# Altium project MSXIV_RearPowerDistribution.PrjPcb (part 3 of 6)

## Sheet Power Distribution - Power Path.SchDoc: Power Path
size B; Organization: Midnight Sun Solar Rayce Car Team; Address1: University of Waterloo; Address2: 200 University Ave W; Address3: Waterloo, ON, Canada; Address4: N2L 3E9; DocumentNumber: 6; SheetNumber: 6; SheetTotal: 13; Website: www.uwmidsun.com; ProjectName: ProjectName
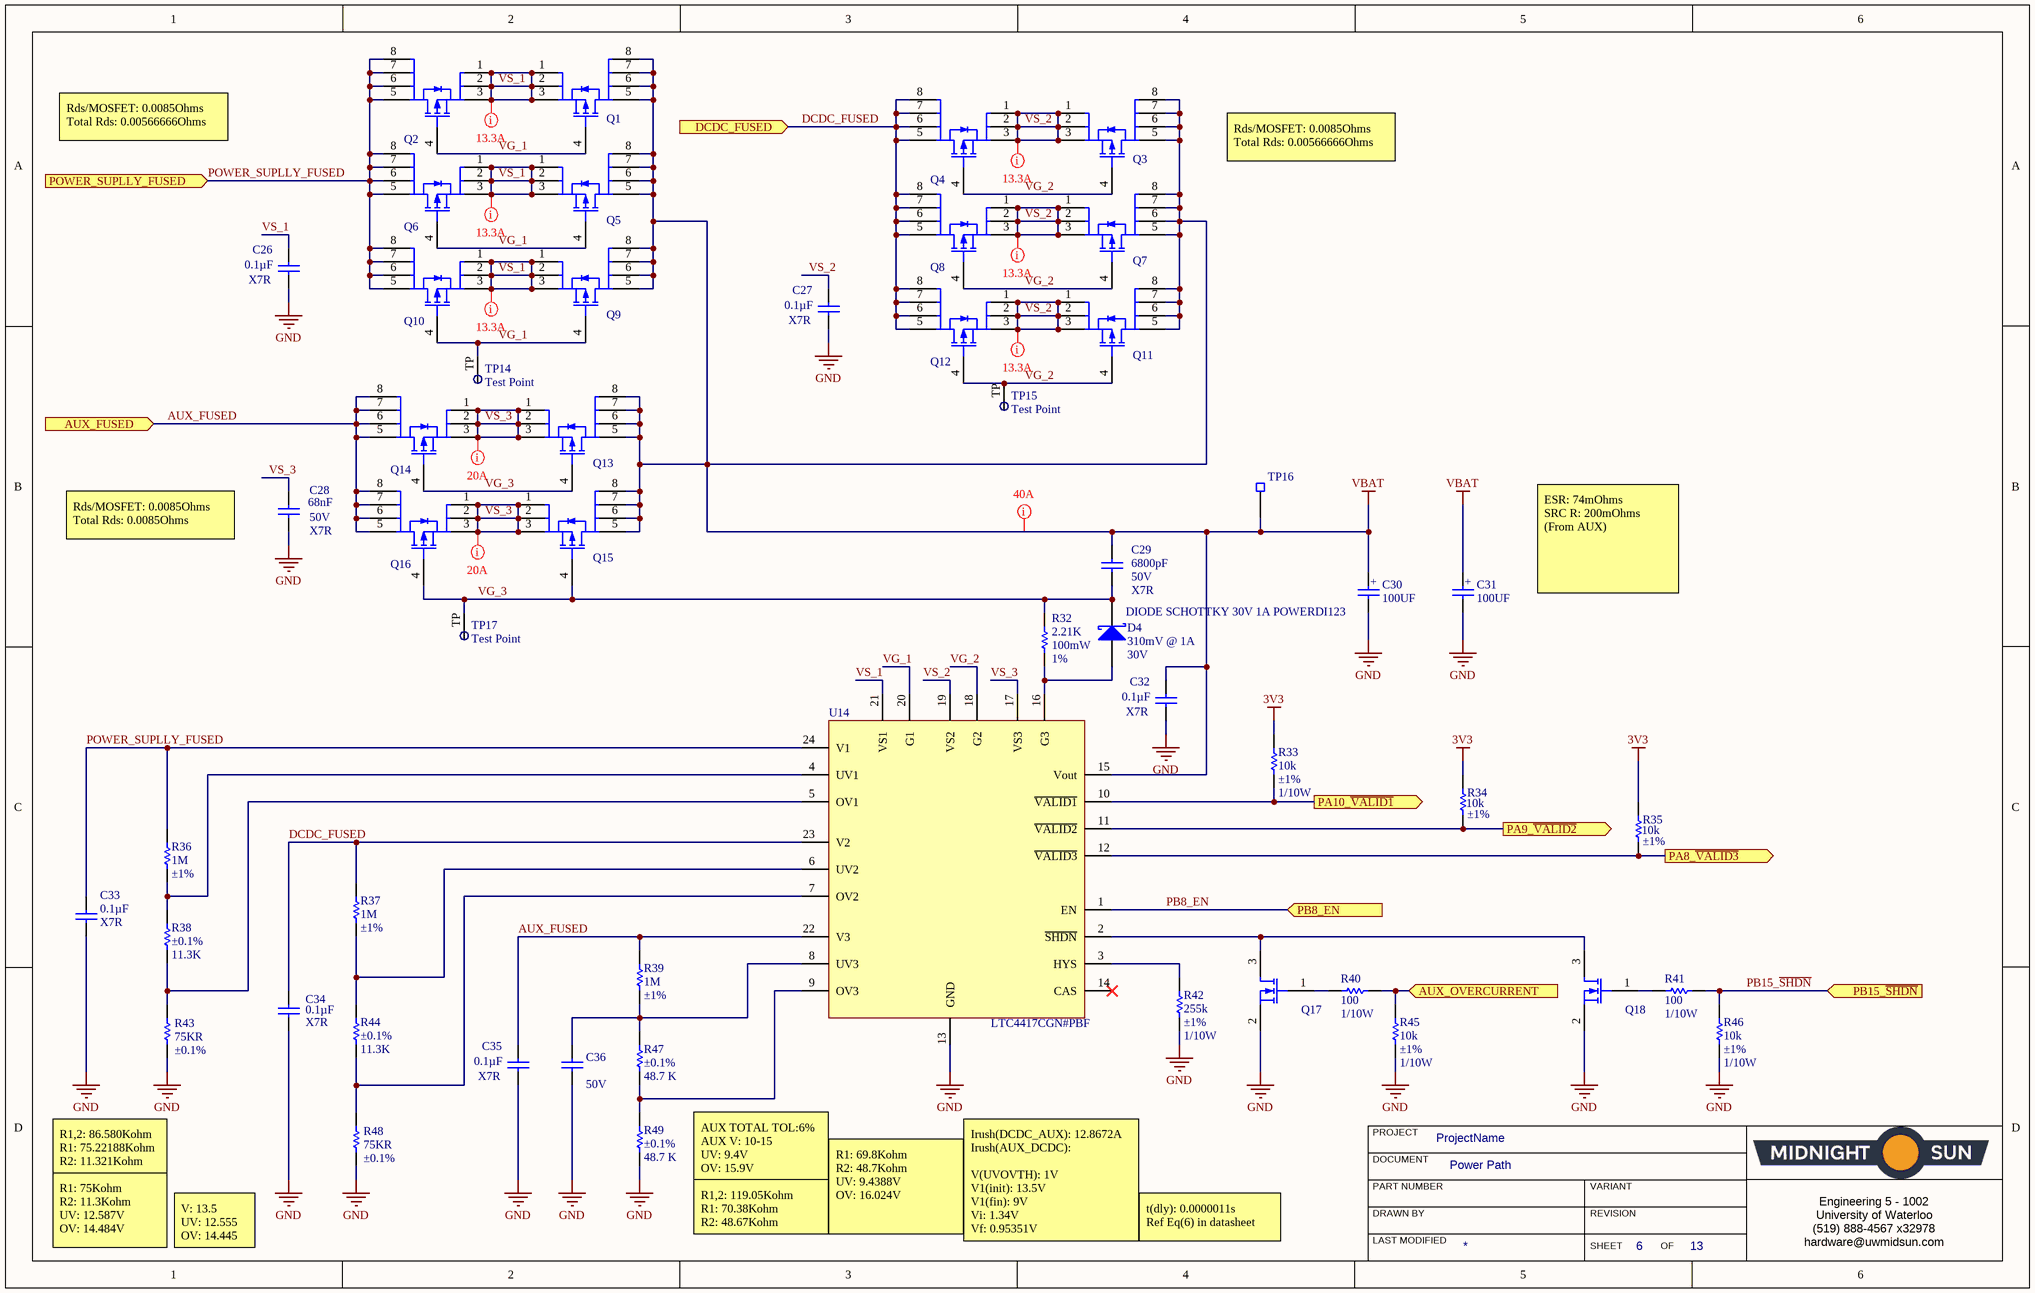
[diagram p5: Power Distribution - Power Path.SchDoc]

### Parts
(Parts that share a designator on the sheet are numbered #1, #2 ... from top to bottom, then left to right.)
C26  Capacitance: 0.1µF  Temperature Coefficient: X7R  [CAP, 0603]  (hidden comment: CAP CER 0.1UF 50V 10% X7R 0603)
C27  Capacitance: 0.1µF  Temperature Coefficient: X7R  [CAP, 0603]  (hidden comment: CAP CER 0.1UF 50V 10% X7R 0603)
C28  68nF  Voltage Rating: 50V  Dielectric: X7R  [CAP, 0603]
C29  Capacitance: 6800pF  Voltage: 50V  Temperature Coefficient: X7R  [CAP, 0603]  (hidden comment: CAP CER 6800pF 50V 10% X7R 0603)
C30  100UF  [CAP ALUM 6.3MM RADIAL SMD]
C31  100UF  [CAP ALUM 6.3MM RADIAL SMD]  (no BOM)
C32  Capacitance: 0.1µF  Temperature Coefficient: X7R  [CAP, 0603]  (hidden comment: CAP CER 0.1UF 50V 10% X7R 0603)
C33  Capacitance: 0.1µF  Temperature Coefficient: X7R  [CAP, 0603]  (hidden comment: CAP CER 0.1UF 50V 10% X7R 0603)
C34  Capacitance: 0.1µF  Temperature Coefficient: X7R  [CAP, 0603]  (hidden comment: CAP CER 0.1UF 50V 10% X7R 0603)
C35  Capacitance: 0.1µF  Temperature Coefficient: X7R  [CAP, 0603]  (hidden comment: CAP CER 0.1UF 50V 10% X7R 0603)
C36#1  Voltage - Rated: 50V  [CAP, 0603]  (hidden comment: CAP CER 0.022UF 50V 10% X7R 0603)
D4  DIODE SCHOTTKY 30V 1A POWERDI123  Voltage - Forward (Vf) (Max) @ If: 310mV @ 1A  Voltage - DC Reverse (Vr) (Max): 30V  [DIODE SCHOTTKY 30V 1A POWERDI123]
Q1  MOSFET P-CH PWR56 40V 4.9 MOHM  [PMOS PWR56 40V 4.9 MOHM]  (value not drawn)
Q2  MOSFET P-CH PWR56 40V 4.9 MOHM  [PMOS PWR56 40V 4.9 MOHM]  (value not drawn)
Q3  MOSFET P-CH PWR56 40V 4.9 MOHM  [PMOS PWR56 40V 4.9 MOHM]  (value not drawn)
Q4  MOSFET P-CH PWR56 40V 4.9 MOHM  [PMOS PWR56 40V 4.9 MOHM]  (value not drawn)
Q5  MOSFET P-CH PWR56 40V 4.9 MOHM  [PMOS PWR56 40V 4.9 MOHM]  (value not drawn)
Q6  MOSFET P-CH PWR56 40V 4.9 MOHM  [PMOS PWR56 40V 4.9 MOHM]  (value not drawn)
Q7  MOSFET P-CH PWR56 40V 4.9 MOHM  [PMOS PWR56 40V 4.9 MOHM]  (value not drawn)
Q8  MOSFET P-CH PWR56 40V 4.9 MOHM  [PMOS PWR56 40V 4.9 MOHM]  (value not drawn)
Q9  MOSFET P-CH PWR56 40V 4.9 MOHM  [PMOS PWR56 40V 4.9 MOHM]  (value not drawn)
Q10  MOSFET P-CH PWR56 40V 4.9 MOHM  [PMOS PWR56 40V 4.9 MOHM]  (value not drawn)
Q11  MOSFET P-CH PWR56 40V 4.9 MOHM  [PMOS PWR56 40V 4.9 MOHM]  (value not drawn)
Q12  MOSFET P-CH PWR56 40V 4.9 MOHM  [PMOS PWR56 40V 4.9 MOHM]  (value not drawn)
Q13  MOSFET P-CH PWR56 40V 4.9 MOHM  [PMOS PWR56 40V 4.9 MOHM]  (value not drawn)
Q14  MOSFET P-CH PWR56 40V 4.9 MOHM  [PMOS PWR56 40V 4.9 MOHM]  (value not drawn)
Q15  MOSFET P-CH PWR56 40V 4.9 MOHM  [PMOS PWR56 40V 4.9 MOHM]  (value not drawn)
Q16  MOSFET P-CH PWR56 40V 4.9 MOHM  [PMOS PWR56 40V 4.9 MOHM]  (value not drawn)
Q17  MOSFET N-CH 30V 6.2A 0.9W SOT-23  [MOSFET N-CH 30V 6.2A 0.9W SOT-23]  (value not drawn)
Q18  MOSFET N-CH 30V 6.2A 0.9W SOT-23  [MOSFET N-CH 30V 6.2A 0.9W SOT-23]  (value not drawn)
R32  2.21K  Tolerance: 1%  Max Power Dissipation: 100mW  [RES, 0603]
R33  Resistance: 10k  Tolerance: ±1%  Power: 1/10W  [RES, 0603]  (hidden comment: RES 10K OHM 1% 1/10W 0603)
R34  Resistance: 10k  Tolerance: ±1%  [RES, 0603]  (hidden comment: RES 10K OHM 1% 1/10W 0603)
R35  Resistance: 10k  Tolerance: ±1%  [RES, 0603]  (hidden comment: RES 10K OHM 1% 1/10W 0603)
R36  Resistance (Ohms): 1M  Tolerance: ±1%  [RES, 0603]  (hidden comment: RES 1M OHM 1% 1/10W 0603)
R37  Resistance (Ohms): 1M  Tolerance: ±1%  [RES, 0603]  (hidden comment: RES 1M OHM 1% 1/10W 0603)
R38  value 11.3K  Tolerance: ±0.1%  [RES, 0603]  (hidden comment: RES SMD 11.3KOHM 0.1% 1/10W 0603)
R39  Resistance (Ohms): 1M  Tolerance: ±1%  [RES, 0603]  (hidden comment: RES 1M OHM 1% 1/10W 0603)
R40  Resistance: 100  Power: 1/10W  [RES, 0603]  (hidden comment: RES 100 OHM 1% 1/10W 0603)
R41  Resistance: 100  Power: 1/10W  [RES, 0603]  (hidden comment: RES 100 OHM 1% 1/10W 0603)
R42  Resistance (Ohms): 255k  Tolerance: ±1%  Power (Watts): 1/10W  [RES, 0603]  (hidden comment: RES 255K OHM 1% 1/10W 0603)
R43  value 75KR  Tolerance: ±0.1%  [RES, 0603]  (hidden comment: RES SMD 75K OHM 0.1% 1/10W 0603)
R44  value 11.3K  Tolerance: ±0.1%  [RES, 0603]  (hidden comment: RES SMD 11.3KOHM 0.1% 1/10W 0603)
R45  Resistance: 10k  Tolerance: ±1%  Power: 1/10W  [RES, 0603]  (hidden comment: RES 10K OHM 1% 1/10W 0603)
R46  Resistance: 10k  Tolerance: ±1%  Power: 1/10W  [RES, 0603]  (hidden comment: RES 10K OHM 1% 1/10W 0603)
R47  value 48.7 K  Tolerance: ±0.1%  [RES, 0603]  (hidden comment: RES SMD 48.7KOHM 0.1% 1/10W 0603)
R48  value 75KR  Tolerance: ±0.1%  [RES, 0603]  (hidden comment: RES SMD 75K OHM 0.1% 1/10W 0603)
R49  value 48.7 K  Tolerance: ±0.1%  [RES, 0603]  (hidden comment: RES SMD 48.7KOHM 0.1% 1/10W 0603)
TP14  Test Point  [Test Point]  (no BOM)
TP15  Test Point  [Test Point]  (no BOM)
TP16  Test Point 0603 SMD  [TEST POINT 0603 SMD]  (value not drawn)
TP17  Test Point  [Test Point]  (no BOM)
U14  Manufacturer Part Number 1: LTC4417CGN#PBF  [IC OR CTRLR SRC SELECT 24SSOP]  (hidden comment: IC OR CONTROLLER SOURCE SELECT 24SSOP)

### Ports
AUX_FUSED (in), AUX_OVERCURRENT (in), DCDC_FUSED (in), PA8_~{VALID3} (out), PA9_~{VALID2} (out), PA10_~{VALID1} (out), PB8_EN (in), PB15_~{SHDN} (in), POWER_SUPLLY_FUSED (in)

### Nets
3V3: R33.1 R34.1 R35.1
GND: C26.2 C27.2 C28.2 C30.2 C31.2 C32.2 C33.2 C34.2 C35.2 C36#1.2 Q17.2(S) Q18.2(S) R42.2 R43.2 R45.2 R46.2 R48.2 R49.2 U14.13(GND)
VBAT: C29.1 C30.1 C31.1 C32.1 Q1.5(D) Q1.6(D) Q1.7(D) Q1.8(D) Q3.5(D) Q3.6(D) Q3.7(D) Q3.8(D) Q5.5(D) Q5.6(D) Q5.7(D) Q5.8(D) Q7.5(D) Q7.6(D) Q7.7(D) Q7.8(D) Q9.5(D) Q9.6(D) Q9.7(D) Q9.8(D) Q11.5(D) Q11.6(D) Q11.7(D) Q11.8(D) Q13.5(D) Q13.6(D) Q13.7(D) Q13.8(D) Q15.5(D) Q15.6(D) Q15.7(D) Q15.8(D) TP16.1 U14.15(Vout)
AUX_FUSED: C35.1 Q14.5(D) Q14.6(D) Q14.7(D) Q14.8(D) Q16.5(D) Q16.6(D) Q16.7(D) Q16.8(D) R39.1 U14.22(V3) ; port AUX_FUSED
AUX_OVERCURRENT: R40.2 R45.1 ; port AUX_OVERCURRENT
DCDC_FUSED: C34.1 Q4.5(D) Q4.6(D) Q4.7(D) Q4.8(D) Q8.5(D) Q8.6(D) Q8.7(D) Q8.8(D) Q12.5(D) Q12.6(D) Q12.7(D) Q12.8(D) R37.1 U14.23(V2) ; port DCDC_FUSED
PA8_~{VALID3}: R35.2 U14.12(~{VALID3}) ; port PA8_~{VALID3}
PA9_~{VALID2}: R34.2 U14.11(~{VALID2}) ; port PA9_~{VALID2}
PA10_~{VALID1}: R33.2 U14.10(~{VALID1}) ; port PA10_~{VALID1}
PB8_EN: U14.1(EN) ; port PB8_EN
PB15_~{SHDN}: R41.2 R46.1 ; port PB15_~{SHDN}
POWER_SUPLLY_FUSED: C33.1 Q2.5(D) Q2.6(D) Q2.7(D) Q2.8(D) Q6.5(D) Q6.6(D) Q6.7(D) Q6.8(D) Q10.5(D) Q10.6(D) Q10.7(D) Q10.8(D) R36.1 U14.24(V1) ; port POWER_SUPLLY_FUSED
VG_1: Q1.4(G) Q2.4(G) Q5.4(G) Q6.4(G) Q9.4(G) Q10.4(G) TP14.TP U14.20(G1)
VG_2: Q3.4(G) Q4.4(G) Q7.4(G) Q8.4(G) Q11.4(G) Q12.4(G) TP15.TP U14.18(G2)
VG_3: C29.2 D4.2(K) Q13.4(G) Q14.4(G) Q15.4(G) Q16.4(G) R32.1 TP17.TP
VS_1: C26.1 Q1.1(S) Q1.2(S) Q1.3(S) Q2.1(S) Q2.2(S) Q2.3(S) Q5.1(S) Q5.2(S) Q5.3(S) Q6.1(S) Q6.2(S) Q6.3(S) Q9.1(S) Q9.2(S) Q9.3(S) Q10.1(S) Q10.2(S) Q10.3(S) U14.21(VS1)
VS_2: C27.1 Q3.1(S) Q3.2(S) Q3.3(S) Q4.1(S) Q4.2(S) Q4.3(S) Q7.1(S) Q7.2(S) Q7.3(S) Q8.1(S) Q8.2(S) Q8.3(S) Q11.1(S) Q11.2(S) Q11.3(S) Q12.1(S) Q12.2(S) Q12.3(S) U14.19(VS2)
VS_3: C28.1 Q13.1(S) Q13.2(S) Q13.3(S) Q14.1(S) Q14.2(S) Q14.3(S) Q15.1(S) Q15.2(S) Q15.3(S) Q16.1(S) Q16.2(S) Q16.3(S) U14.17(VS3)
NetC36#1_1: C36#1.1 R39.2 R47.1 U14.8(UV3)
NetD4_1: D4.1(A) R32.2 U14.16(G3)
NetQ17_1: Q17.1(G) R40.1
NetQ17_3: Q17.3(D) Q18.3(D) U14.2(~{SHDN})
NetQ18_1: Q18.1(G) R41.1
NetR36_2: R36.2 R38.1 U14.4(UV1)
NetR37_2: R37.2 R44.1 U14.6(UV2)
NetR38_2: R38.2 R43.1 U14.5(OV1)
NetR42_1: R42.1 U14.3(HYS)
NetR44_2: R44.2 R48.1 U14.7(OV2)
NetR47_2: R47.2 R49.1 U14.9(OV3)

Not connected (* = marked no-connect by the designer): U14 14(CAS)*

### Layout directives
net class HighCurrent; rule Power Plane Connect Style [Style - Direct Connect]; rule Polygon Connect Style [Style - Direct Connect]: VBAT, VS_1, VS_2, VS_3

### Notes on the sheet
- Rds/MOSFET: 0.0085Ohms
  Total Rds: 0.00566666Ohms
- Rds/MOSFET: 0.0085Ohms
  Total Rds: 0.0085Ohms
- ESR: 74mOhms
  SRC R: 200mOhms (From AUX)
- R1,2: 86.580Kohm
  R1: 75.22188Kohm
  R2: 11.321Kohm
- AUX TOTAL TOL:6%
  AUX V: 10-15
  UV: 9.4V
  OV: 15.9V
- R1: 75Kohm
  R2: 11.3Kohm
  UV: 12.587V
  OV: 14.484V
- V: 13.5
  UV: 12.555
  OV: 14.445
- R1,2: 119.05Kohm
  R1: 70.38Kohm
  R2: 48.67Kohm
- R1: 69.8Kohm
  R2: 48.7Kohm
  UV: 9.4388V
  OV: 16.024V
- Irush(DCDC_AUX): 12.8672A
  Irush(AUX_DCDC):
  V(UVOVTH): 1V
  V1(init): 13.5V
  V1(fin): 9V
  Vi: 1.34V
  Vf: 0.95351V
- t(dly): 0.0000011s
  Ref Eq(6) in datasheet
- PROJECT
- DOCUMENT
- DRAWN BY
- LAST MODIFIED
- PART NUMBER
- REVISION
- SHEET
- VARIANT
- OF
- Engineering 5 - 1002
  University of Waterloo
  (519) 888-4567 x32978
  hardware@uwmidsun.com
- (in symbol CAP ALUM 100UF 20% 35V SMD) +

### Library data of the parts
C26 C27 C32-C35 = CAP CER 0.1UF 50V 10% X7R 0603: as C1 on sheet Controller_Board_Interface; Supplier 1: Digi-Key; Supplier Part Number 1: 478-5052-1-ND; Packaging: Cut Tape (CT); Part Status: Active; Operating Temperature: -55°C ~ 125°C; Ratings: -; Mounting Type: Surface Mount, MLCC; Package / Case: 0603 (1608 Metric); Size / Dimension: 0.063" L x 0.032" W (1.60mm x 0.81mm); Height - Seated (Max): -; Thickness (Max): 0.035" (0.90mm); Lead Spacing: -; Lead Style: -; ComponentLink1URL: http://datasheets.avx.com/X7RDielectric.pdf; ComponentLink1Description: http://datasheets.avx.com/X7RDielectric.pdf; Tolerance: ±10%; Voltage: 50V
C28 = CAP CER 0.068UF 10% 50V X7R 0603: 0.068µF 50V Ceramic Capacitor X7R 0603 (1608 Metric) 0.063" L x 0.032" W (1.60mm x 0.80mm); Manufacturer: Murata; Manufacturer Part Number: GCM188R71H683KA57D; Tolerance: 10%; Supplier 1: Digi-Key; Stock 1: 40000; Pricing 1: 1=0.16, 10=0.116, 100=0.0547, 500=0.03832, 1000=0.03172 (USD); Mount: Surface Mount; Case/Package: 0603; Case Code (Metric): 1608; Case Code (Imperial): 0603; Min Operating Temperature: -55°C; Max Operating Temperature: 125°C; Packaging: Tape and Reel; Capacitance: 68nF; Package Quantity: 4000; Voltage Rating (DC): 50V; Termination: SMD/SMT; Length: 1.6mm; Height: 0.8mm; Width: 0.031inch; Thickness: 0.035inch; Depth: 0.8mm; Radiation Hardening: No; ComponentLink1URL: https://datasheet.ciiva.com/29542/s0717e-29542427.pdf; ComponentLink1Description: https://datasheet.ciiva.com/29542/s0717e-29542427.pdf; ComponentLink2URL: https://datasheet.ciiva.com/29542/s0717e-29542428.pdf; ComponentLink2Description: https://datasheet.ciiva.com/29542/s0717e-29542428.pdf; ComponentLink3URL: https://datasheet.ciiva.com/29542/s0717e-29542429.pdf; ComponentLink3Description: https://datasheet.ciiva.com/29542/s0717e-29542429.pdf; Supplier Part Number 1: 490-8027-1-ND
C29 = CAP CER 6800pF 50V 10% X7R 0603: 6800pF ±10% 50V Ceramic Capacitor X7R 0603 (1608 Metric); Manufacturer 1: Samsung Electro-Mechanics America, Inc.; Manufacturer Part Number 1: CL10B682KB8SFNC; Supplier 1: Digi-Key; Supplier Part Number 1: 1276-2103-1-ND; Packaging: Cut Tape (CT); Part Status: Active; Operating Temperature: -55°C ~ 125°C; Ratings: -; Mounting Type: Surface Mount, MLCC; Package / Case: 0603 (1608 Metric); Size / Dimension: 0.063" L x 0.031" W (1.60mm x 0.80mm); Height - Seated (Max): -; Thickness (Max): 0.035" (0.90mm); Lead Spacing: -; Lead Style: -; ComponentLink1URL: http://www.samsungsem.com/kr/support/product-search/mlcc/CL10B682KB8SFNC.jsp; ComponentLink1Description: http://www.samsungsem.com/kr/support/product-search/mlcc/CL10B682KB8SFNC.jsp; Tolerance: ±10%
C30 C31 = CAP ALUM 100UF 20% 35V SMD: 100µF 35V Aluminum Electrolytic Capacitors Radial, Can - SMD 2000 Hrs @ 85°C; Manufacturer 1: Panasonic; Manufacturer Part Number 1: EEE-1VA101XP; Description 1: Cap Aluminum Lytic 100uF 35V 20% (6.3 X 7.7mm) SMD 132mA 2000h 85C Automotive T/R; Tolerance: 20%; Ripple Current: 132mA; Polarity: Polar; Life (Hours): 2000Hour; Leakage Current: 3uA; Supplier 1: Digi-Key; Supplier Part Number 1: PCE3951CT-ND; Stock 1: 170823; Pricing 1: 1=0.44, 10=0.304, 100=0.1822 (USD); Mount: Surface Mount,PCB; Case/Package: Radial; Number of Pins: 8; Contact Plating: Tin; Min Operating Temperature: -40°C; Max Operating Temperature: 85°C; Capacitance: 100uF; Voltage Rating: 35V; Packaging: Tape and Reel; Package Quantity: 900; Ripple Current (AC): 132mA; Voltage Rating (DC): 35V; Termination: SMD/SMT; Voltage: 35V; Diameter: 6.3mm; Length: 8mm; Height: 7.7mm; Height - Seated (Max): 0.303inch; Radiation Hardening: No; REACH SVHC: No SVHC; Lead Free: Lead Free; ComponentLink1URL: https://datasheet.ciiva.com/46378/aba0000ce2-46378341.pdf; ComponentLink1Description: https://datasheet.ciiva.com/46378/aba0000ce2-46378341.pdf; ComponentLink2URL: https://datasheet.ciiva.com/17535/aba0000ce2-17535510.pdf; ComponentLink2Description: https://datasheet.ciiva.com/17535/aba0000ce2-17535510.pdf; ComponentLink3URL: https://datasheet.ciiva.com/30170/11aba0000ce2-30170103.pdf; ComponentLink3Description: https://datasheet.ciiva.com/30170/11aba0000ce2-30170103.pdf; ComponentLink4URL: https://datasheet.ciiva.com/31414/aba0000ce2-31414696.pdf; ComponentLink4Description: https://datasheet.ciiva.com/31414/aba0000ce2-31414696.pdf; ComponentLink5URL: https://datasheet.ciiva.com/24068/aba0000ce2-40801-24068089.pdf; ComponentLink5Description: https://datasheet.ciiva.com/24068/aba0000ce2-40801-24068089.pdf; ComponentLink6URL: https://datasheet.ciiva.com/14591/70255710-14591771.pdf; ComponentLink6Description: https://datasheet.ciiva.com/14591/70255710-14591771.pdf; ComponentLink7URL: https://datasheet.ciiva.com/14600/70255710-14600731.pdf; ComponentLink7Description: https://datasheet.ciiva.com/14600/70255710-14600731.pdf; ComponentLink8URL: https://datasheet.ciiva.com/46374/aba0000ce2-46374427.pdf; ComponentLink8Description: https://datasheet.ciiva.com/46374/aba0000ce2-46374427.pdf; ComponentLink9URL: https://datasheet.ciiva.com/11673/aba0000ce2-11673887.pdf; ComponentLink9Description: https://datasheet.ciiva.com/11673/aba0000ce2-11673887.pdf
C36#1 = CAP CER 0.022UF 50V 10% X7R 0603: 0.022µF ±10% 50V Ceramic Capacitor X7R 0603 (1608 Metric); Manufacturer 1: Murata Electronics North America; Manufacturer Part Number 1: GRM188R71H223KA01D; Description 1: CAP CER 0.022UF 50V X7R 0603; Supplier 1: Digi-Key; Supplier Part Number 1: 490-1517-1-ND; RoHS: RoHS Compliant; Category: Capacitors; Stock 1: 612330; Pricing 1: 1=0.15, 10=0.111, 100=0.0499, 500=0.03564, 1000=0.02801 (CAD); Packaging: Cut Tape (CT); Part Status: Active; Tolerance: ±10%; Temperature Coefficient: X7R; Operating Temperature: -55°C ~ 125°C; Features: -; Ratings: -; Applications: General Purpose; Mounting Type: Surface Mount, MLCC; Package / Case: 0603 (1608 Metric); Size / Dimension: 0.063" L x 0.032" W (1.60mm x 0.80mm); Height - Seated (Max): -; Thickness (Max): 0.035" (0.90mm); Lead Spacing: -; Lead Style: -; ComponentLink1URL: http://search.murata.co.jp/Ceramy/image/img/A01X/G101/ENG/GRM188R71H223KA01-01.pdf; ComponentLink1Description: http://search.murata.co.jp/Ceramy/image/img/A01X/G101/ENG/GRM188R71H223KA01-01.pdf
D4 = DIODE SCHOTTKY 30V 1A POWERDI123: Diode Schottky 30V 1A Surface Mount PowerDI™ 123; Manufacturer: Diodes Incorporated; Manufacturer Part Number: DFLS130L-7; Speed: Fast Recovery =< 500ns, > 200mA (Io); Current - Reverse Leakage @ Vr: 1mA @ 30V; Capacitance @ Vr, F: 76pF @ 10V, 1MHz; Supplier 1: Digi-Key; RoHS: RoHS Compliant; Category: Discrete Semiconductor Products; Stock 1: 68200; Packaging: Cut Tape (CT); Part Status: Active; Diode Type: Schottky; Mounting Type: Surface Mount; Package / Case: POWERDI®123; Supplier Device Package: PowerDI™ 123; Operating Temperature - Junction: -40°C ~ 125°C; ComponentLink1URL: https://www.diodes.com/assets/Datasheets/ds30492.pdf; ComponentLink1Description: https://www.diodes.com/assets/Datasheets/ds30492.pdf; Supplier Part Number 1: DFLS130LDICT-ND; Pricing 1: 1=0.7, 10=0.599, 100=0.447, 500=0.35126, 1000=0.27142 (CAD); Current - Average Rectified (Io): 1A
Q1-Q16 = MOSFET P-CH PWR56 40V 4.9 MOHM: P-Channel 16V 2.5A (Ta) 650mW (Ta) Surface Mount X2-DFN2015-3; Current - Continuous Drain (Id) @ 25°C: 80A (Tc); Drive Voltage (Max Rds On,  Min Rds On): 4.5V, 10V; Vgs(th) (Max) @ Id: 3V @ 250µA; Gate Charge (Qg) (Max) @ Vgs: 107nC @ 10V; Input Capacitance (Ciss) (Max) @ Vds: 4840pF @ 20V; Power Dissipation (Max): 214W (Tj); Rds On (Max) @ Id, Vgs: 4.9mOhm @ 80A, 10V; Packaging: Cut Tape (CT); Part Status: Active; FET Type: P-Channel; Technology: MOSFET (Metal Oxide); Drain to Source Voltage (Vdss): 40V; Vgs (Max): ±16V; FET Feature: -; Operating Temperature: -55°C ~ 175°C (TJ); Mounting Type: Surface Mount; Supplier Device Package: FDWS9508L-F085OSCT-ND; Package / Case: 8-PowerTDFN; ComponentLink1URL: https://www.onsemi.com/pub/Collateral/FDWS9508L-F085-D.PDF; ComponentLink1Description: https://www.onsemi.com/pub/Collateral/FDWS9508L-F085-D.PDF; Supplier 1: Digi-Key; Supplier Part Number 1: FDWS9508L-F085OSCT-ND
Q17 Q18 = MOSFET N-CH 30V 6.2A 0.9W SOT-23: N-Channel 30V 6.2A (Ta) 900mW (Ta) Surface Mount SOT-23; Manufacturer: Diodes; Manufacturer Part Number: DMN3023L-7; Rds On Max: 25mR; Input Capacitance: 873pF; Supplier 1: Digi-Key; Stock 1: 38246; Pricing 1: 1=0.47, 10=0.368, 100=0.2529, 500=0.1734, 1000=0.1301 (USD); Mount: Surface Mount; Case/Package: TO-236-3; Min Operating Temperature: -55°C; Max Operating Temperature: 150°C; Packaging: Tape and Reel; Drain to Source Voltage (Vdss): 30V; Continuous Drain Current (ID): 6.2A; Max Power Dissipation: 900mW; ComponentLink1URL: https://www.diodes.com/assets/Datasheets/DMN3023L.pdf; ComponentLink1Description: https://www.diodes.com/assets/Datasheets/DMN3023L.pdf; ComponentLink2URL: http://www.mouser.com/ds/2/115/DMN3023L-959533.pdf; ComponentLink2Description: http://www.mouser.com/ds/2/115/DMN3023L-959533.pdf; Supplier Part Number 1: DMN3023L-7DICT-ND
R32 = RES 2.21K OHM 1% 1/10W 0603: 2.21 kOhms ±1% 0.1W, 1/10W Chip Resistor 0603 (1608 Metric) Automotive AEC-Q200, Moisture Resistant Thick Film; Manufacturer: Yageo; Manufacturer Part Number: AC0603FR-072K21L; Voltage Rating: 50V; Resistance: 2.21kR; Temperature Coefficient: 100ppm/°C; Working Voltage: 75V; Supplier 1: Digi-Key; Stock 1: 11020; Pricing 1: 1=0.1, 10=0.029, 100=0.0117, 1000=0.00527, 2500=0.00458 (USD); Case/Package: 0603; Weight: 7.1E-05oz; Case Code (Imperial): 0603; Case Code (Metric): 1608; Min Operating Temperature: -55°C; Max Operating Temperature: 155°C; Power Rating: 100mW; Packaging: Tape and Reel; Composition: Thick Film; Termination: SMD/SMT; Number of Terminations: 2; Length: 0.063inch; Height: 0.022inch; Width: 0.8mm; Lead Free: Lead Free; ComponentLink1URL: https://datasheet.ciiva.com/12576/pyu-ac-51-rohs-l-2-12576458.pdf; ComponentLink1Description: https://datasheet.ciiva.com/12576/pyu-ac-51-rohs-l-2-12576458.pdf; Supplier Part Number 1: YAG3586CT-ND
R33-R35 R45 R46 = RES 10K OHM 1% 1/10W 0603: RES SMD 10K OHM 1% 1/10W 0603; Manufacturer 1: Yageo; Manufacturer Part Number 1: RC0603FR-0710KL; Temperature Coefficient: ±100ppm/°C; Supplier 1: Digi-Key; Supplier Part Number 1: 311-10.0KHRCT-ND; Packaging: Cut Tape (CT); Part Status: Active; Composition: Thick Film; Operating Temperature: -55°C ~ 155°C; Package / Case: 0603 (1608 Metric); Supplier Device Package: 0603; Size / Dimension: 0.063" L x 0.031" W (1.60mm x 0.80mm); Height - Seated (Max): 0.022" (0.55mm); Failure Rate: -; ComponentLink1URL: http://www.yageo.com/documents/recent/PYu-RC_Group_51_RoHS_L_7.pdf; ComponentLink1Description: http://www.yageo.com/documents/recent/PYu-RC_Group_51_RoHS_L_7.pdf
R36 R37 R39 = RES 1M OHM 1% 1/10W 0603: 1M Ohm ±1% 0.1W, 1/10W Chip Resistor 0603 (1608 Metric) Moisture Resistant Thick Film; Manufacturer 1: Yageo; Manufacturer Part Number 1: RC0603FR-071ML; Description 1: RES SMD 1M OHM 1% 1/10W 0603; Temperature Coefficient: ±100ppm/°C; Supplier 1: Digi-Key; Supplier Part Number 1: 311-1.00MHRCT-ND; RoHS: RoHS Compliant; Category: Resistors; Stock 1: 2336711; Pricing 1: 1=0.16, 10=0.022, 100=0.0089, 1000=0.00402, 2500=0.00349 (CAD); Packaging: Cut Tape (CT); Part Status: Active; Composition: Thick Film; Features: Moisture Resistant; Operating Temperature: -55°C ~ 155°C; Package / Case: 0603 (1608 Metric); Supplier Device Package: 0603; Size / Dimension: 0.063" L x 0.031" W (1.60mm x 0.80mm); Height - Seated (Max): 0.022" (0.55mm); Failure Rate: -; ComponentLink1URL: http://www.yageo.com/documents/recent/PYu-RC_Group_51_RoHS_L_7.pdf; ComponentLink1Description: http://www.yageo.com/documents/recent/PYu-RC_Group_51_RoHS_L_7.pdf
R38 R44 = RES SMD 11.3KOHM 0.1% 1/10W 0603: 11.3 kOhms ±0.1% 0.1W, 1/10W Chip Resistor 0603 (1608 Metric) Automotive AEC-Q200 Thin Film; Manufacturer: Panasonic Electronic Components; Temperature Coefficient: ±25ppm/°C; Series: ERA-3A; Packaging: Cut Tape (CT); Part Status: Active; Resistance: 11.3 kOhms; Power (Watts): 0.1W, 1/10W; Composition: Thin Film; Features: Automotive AEC-Q200; Operating Temperature: -55°C ~ 155°C; Package / Case: 0603 (1608 Metric); Supplier Device Package: 0603; Size / Dimension: 0.063" L x 0.031" W (1.60mm x 0.80mm); Height - Seated (Max): 0.022" (0.55mm); Number of Terminations: 2; Supplier 1: Digi-Key; Supplier Part Number 1: P11.3KDBCT-ND
R40 R41 = RES 100 OHM 1% 1/10W 0603: 100 Ohm ±1% 0.1W, 1/10W Chip Resistor 0603 (1608 Metric) Moisture Resistant Thick Film; Manufacturer 1: Yageo; Manufacturer Part Number 1: RC0603FR-07100RL; Temperature Coefficient: ±100ppm/°C; Supplier 1: Digi-Key; Supplier Part Number 1: 311-100HRCT-ND; Packaging: Cut Tape (CT); Part Status: Active; Composition: Thick Film; Operating Temperature: -55°C ~ 155°C; Package / Case: 0603 (1608 Metric); Supplier Device Package: 0603; Size / Dimension: 0.063" L x 0.031" W (1.60mm x 0.80mm); Height - Seated (Max): 0.022" (0.55mm); Failure Rate: -; ComponentLink1URL: http://www.yageo.com/documents/recent/PYu-RC_Group_51_RoHS_L_7.pdf; ComponentLink1Description: http://www.yageo.com/documents/recent/PYu-RC_Group_51_RoHS_L_7.pdf; Tolerance: ±1%
R42 = RES 255K OHM 1% 1/10W 0603: 255k Ohm ±1% 0.1W, 1/10W Chip Resistor 0603 (1608 Metric) Moisture Resistant Thick Film; Manufacturer 1: Yageo; Manufacturer Part Number 1: RC0603FR-07255KL; Description 1: RES SMD 255K OHM 1% 1/10W 0603; Temperature Coefficient: ±100ppm/°C; Supplier 1: Digi-Key; Supplier Part Number 1: 311-255KHRCT-ND; RoHS: RoHS Compliant; Category: Resistors; Stock 1: 106564; Pricing 1: 1=0.16, 10=0.022, 100=0.0089, 1000=0.00402, 2500=0.00349 (CAD); Packaging: Cut Tape (CT); Part Status: Active; Composition: Thick Film; Features: Moisture Resistant; Operating Temperature: -55°C ~ 155°C; Package / Case: 0603 (1608 Metric); Supplier Device Package: 0603; Size / Dimension: 0.063" L x 0.031" W (1.60mm x 0.80mm); Height - Seated (Max): 0.022" (0.55mm); Failure Rate: -; ComponentLink1URL: http://www.yageo.com/documents/recent/PYu-RC_Group_51_RoHS_L_7.pdf; ComponentLink1Description: http://www.yageo.com/documents/recent/PYu-RC_Group_51_RoHS_L_7.pdf
R43 R48 = RES SMD 75K OHM 0.1% 1/10W 0603: 75 kOhms ±0.1% 0.1W, 1/10W Chip Resistor 0603 (1608 Metric) Automotive AEC-Q200 Thin Film; Manufacturer: Panasonic Electronic Components; Manufacturer Part Number: AC0603FR-0775RL; Temperature Coefficient: ±25ppm/°C; RoHS: RoHS Compliant; Category: Resistors; Packaging: Cut Tape (CT); Part Status: Active; Power (Watts): 0.1W, 1/10W; Composition: Thin Film; Features: Automotive AEC-Q200; Operating Temperature: -55°C ~ 155°C; Package / Case: 0603 (1608 Metric); Supplier Device Package: 0603; Size / Dimension: 0.063" L x 0.031" W (1.60mm x 0.80mm); Height - Seated (Max): 0.022" (0.55mm); Failure Rate: -; ComponentLink1URL: http://www.yageo.com/NewPortal/yageodocoutput?fileName=/pdf/R-Chip/PYu-AC_51_RoHS_L_6.pdf; ComponentLink1Description: http://www.yageo.com/NewPortal/yageodocoutput?fileName=/pdf/R-Chip/PYu-AC_51_RoHS_L_6.pdf; Supplier 1: Digi-Key; Supplier Part Number 1: P75KDBCT-ND
R47 R49 = RES SMD 48.7KOHM 0.1% 1/10W 0603: 48.7 kOhms ±0.1% 0.1W, 1/10W Chip Resistor 0603 (1608 Metric) Automotive AEC-Q200 Thin Film; Manufacturer: Panasonic Electronic Components; Categories: Resistors; Temperature Coefficient: ±25ppm/°C; ComponentLink1Description: https://industrial.panasonic.com/cdbs/www-data/pdf/RDM0000/AOA0000C307.pdf; ComponentLink1URL: https://industrial.panasonic.com/cdbs/www-data/pdf/RDM0000/AOA0000C307.pdf; Series: ERA-3A; Packaging: Cut Tape (CT); Part Status: Active; Resistance: 48.7 kOhms; Power (Watts): 0.1W, 1/10W; Composition: Thin Film; Features: Automotive AEC-Q200; Operating Temperature: -55°C ~ 155°C; Package / Case: 0603 (1608 Metric); Supplier Device: Package 0603; Size / Dimension: 0.063" L x 0.031" W (1.60mm x 0.80mm); Height - Seated (Max): 0.022" (0.55mm); Number of Terminations: 2; Supplier 1: Digi-Key; Supplier Part Number 1: P4.87KDBCT-ND
TP16 = Test Point 0603 SMD: Manufacturer 1: TE Connectivity; Manufacturer Part Number 1: 1625854-3; Description 1: Thick Film Resistors - SMD 2000; Resistance: 0mR; Supplier 1: Digi-Key; Supplier Part Number 1: A106145CT-ND; Stock 1: 212628; Pricing 1: 1=0.22, 10=0.211, 25=0.18, 50=0.1574, 100=0.1462, 250=0.12932, 500=0.12368, 1000=0.1012 (USD); Mount: Surface Mount; Case/Package: 0603; Colour: Natural; Case Code (Imperial): 0603; Case Code (Metric): 1608; Min Operating Temperature: -55°C; Max Operating Temperature: 125°C; Packaging: Tape and Reel; Termination: SMD/SMT; Package Quantity: 2000; Military Standard: Not; Length: 1.6mm; Height: 1.15mm; Width: 0.8mm; Depth: 0.8mm; Radiation Hardening: No; ComponentLink1URL: https://datasheet.ciiva.com/30100/1773266-a-30100967.pdf; ComponentLink1Description: https://datasheet.ciiva.com/30100/1773266-a-30100967.pdf; ComponentLink2URL: https://datasheet.ciiva.com/8914/eng-ds-1773266-a-8914634.pdf; ComponentLink2Description: https://datasheet.ciiva.com/8914/eng-ds-1773266-a-8914634.pdf; ComponentLink3URL: https://datasheet.ciiva.com/6439/eng-ds-1773266-a-6439163.pdf; ComponentLink3Description: https://datasheet.ciiva.com/6439/eng-ds-1773266-a-6439163.pdf; ComponentLink4URL: https://datasheet.ciiva.com/6439/eng-ds-1773266-a-6439164.pdf; ComponentLink4Description: https://datasheet.ciiva.com/6439/eng-ds-1773266-a-6439164.pdf; ComponentLink5URL: https://datasheet.ciiva.com/6439/eng-ds-1773266-a-6439165.pdf; ComponentLink5Description: https://datasheet.ciiva.com/6439/eng-ds-1773266-a-6439165.pdf
U14 = IC OR CONTROLLER SOURCE SELECT 24SSOP: OR Controller Source Selector Switch P-Channel 3:1 24-SSOP; Manufacturer 1: Linear Technology; Internal Switch(s): No; Current - Supply: 28µA; Voltage - Supply: 2.5 V ~ 36 V; Supplier 1: Digi-Key; Supplier Part Number 1: LTC4417CGN#PBF-ND; Packaging: Tube; Part Status: Active; Type: Source Selector Switch; FET Type: P-Channel; Ratio - Input:Output: 3:1; Current - Output (Max): -; Operating Temperature: 0°C ~ 70°C; Mounting Type: Surface Mount; Package / Case: 24-SSOP (0.154", 3.90mm Width); Supplier Device Package: 24-SSOP; ComponentLink1URL: http://www.linear.com/docs/42408; ComponentLink1Description: http://www.linear.com/docs/42408

## Sheet Power Distribution - External ADC.SchDoc: External ADC
size B; Organization: Midnight Sun Solar Rayce Car Team; Address1: University of Waterloo; Address2: 200 University Ave W; Address3: Waterloo, ON, Canada; Address4: N2L 3E9; DocumentNumber: 7; SheetNumber: 7; SheetTotal: 13; Website: www.uwmidsun.com; ProjectName: ProjectName
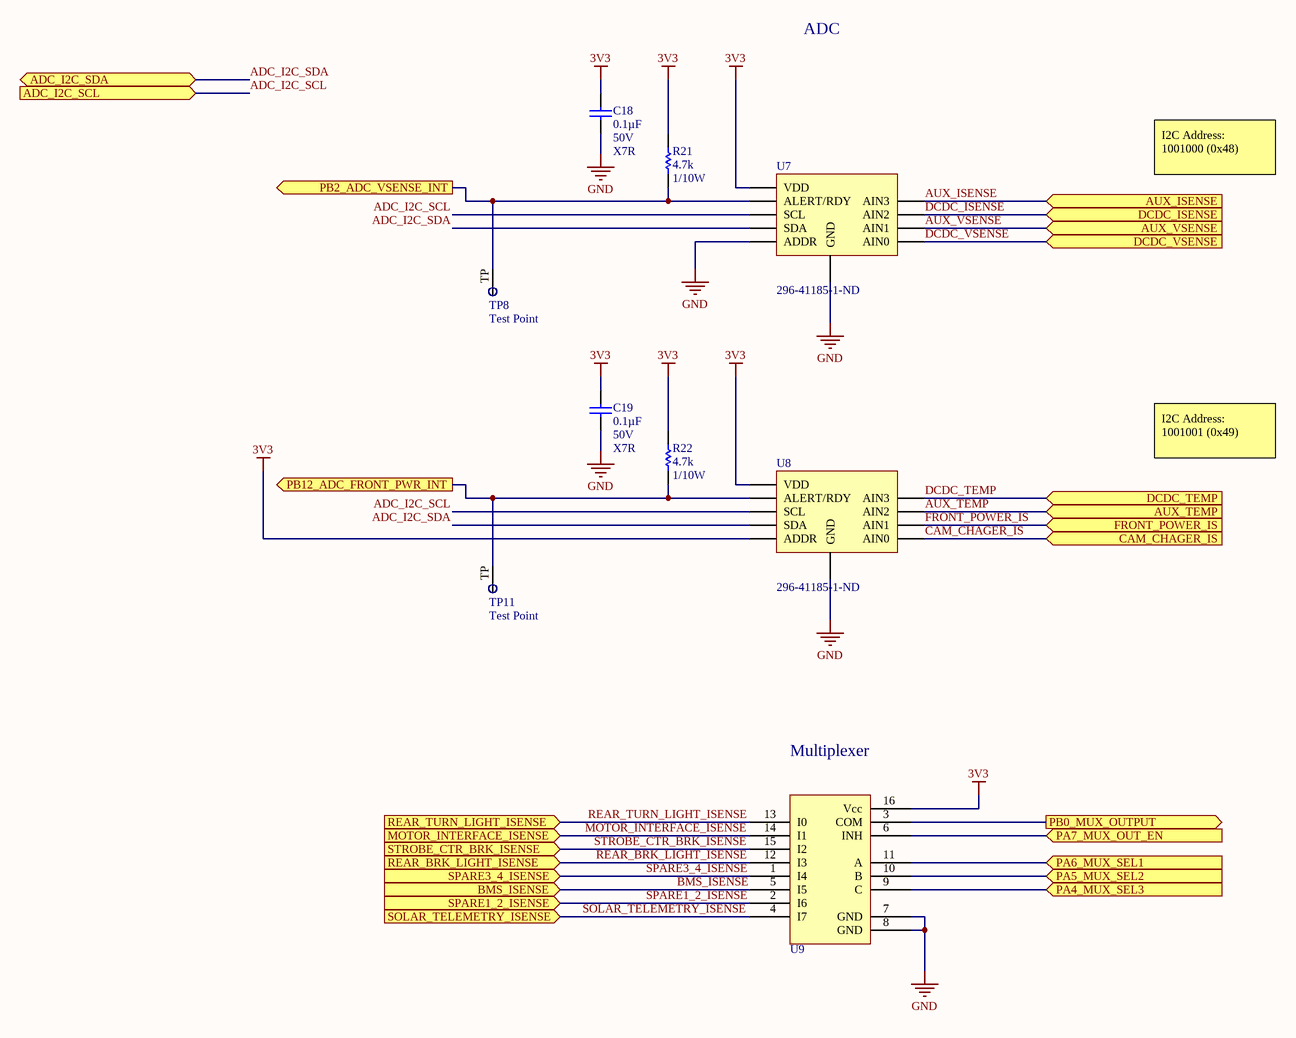
[diagram p6: Power Distribution - External ADC.SchDoc]

### Parts
C18  Capacitance: 0.1µF  Voltage: 50V  Temperature Coefficient: X7R  [CAP, 0603]  (hidden comment: CAP CER 0.1UF 50V 10% X7R 0603)
C19  Capacitance: 0.1µF  Voltage: 50V  Temperature Coefficient: X7R  [CAP, 0603]  (hidden comment: CAP CER 0.1UF 50V 10% X7R 0603)
R21  Resistance (Ohms): 4.7k  Power (Watts): 1/10W  [RES, 0603]  (hidden comment: RES 4.7K OHM 1% 1/10W 0603)
R22  Resistance (Ohms): 4.7k  Power (Watts): 1/10W  [RES, 0603]  (hidden comment: RES 4.7K OHM 1% 1/10W 0603)
TP8  Test Point  [Test Point]  (no BOM)
TP11  Test Point  [Test Point]  (no BOM)
U7  Supplier Part Number 1: 296-41185-1-ND  [IC ADC VSSOP10]  (hidden comment: Quad ADC)
U8  Supplier Part Number 1: 296-41185-1-ND  [IC ADC VSSOP10]  (hidden comment: Quad ADC)
U9  IC MUX/DMUX 8X1 16TSSOP  [16-TSSOP]  (value not drawn)

### Ports
ADC_I2C_SCL (in), ADC_I2C_SDA (bidir), AUX_ISENSE (in), AUX_TEMP (in), AUX_VSENSE (in), BMS_ISENSE (in), CAM_CHAGER_IS (in), DCDC_ISENSE (in), DCDC_TEMP (in), DCDC_VSENSE (in), FRONT_POWER_IS (in), MOTOR_INTERFACE_ISENSE (in), PA4_MUX_SEL3 (in), PA5_MUX_SEL2 (in), PA6_MUX_SEL1 (in), PA7_MUX_OUT_EN (in), PB0_MUX_OUTPUT (out), PB2_ADC_VSENSE_INT (out), PB12_ADC_FRONT_PWR_INT (out), REAR_BRK_LIGHT_ISENSE (in), REAR_TURN_LIGHT_ISENSE (in), SOLAR_TELEMETRY_ISENSE (in), SPARE1_2_ISENSE (in), SPARE3_4_ISENSE (in), STROBE_CTR_BRK_ISENSE (in)

### Nets
3V3: C18.1 C19.1 R21.1 R22.1 U7.8(VDD) U8.1(ADDR) U8.8(VDD) U9.16(Vcc)
GND: C18.2 C19.2 U7.1(ADDR) U7.3(GND) U8.3(GND) U9.7(GND) U9.8(GND)
ADC_I2C_SCL: U7.10(SCL) U8.10(SCL) ; port ADC_I2C_SCL
ADC_I2C_SDA: U7.9(SDA) U8.9(SDA) ; port ADC_I2C_SDA
AUX_ISENSE: U7.7(AIN3) ; port AUX_ISENSE
AUX_TEMP: U8.6(AIN2) ; port AUX_TEMP
AUX_VSENSE: U7.5(AIN1) ; port AUX_VSENSE
BMS_ISENSE: U9.5(I5) ; port BMS_ISENSE
CAM_CHAGER_IS: U8.4(AIN0) ; port CAM_CHAGER_IS
DCDC_ISENSE: U7.6(AIN2) ; port DCDC_ISENSE
DCDC_TEMP: U8.7(AIN3) ; port DCDC_TEMP
DCDC_VSENSE: U7.4(AIN0) ; port DCDC_VSENSE
FRONT_POWER_IS: U8.5(AIN1) ; port FRONT_POWER_IS
MOTOR_INTERFACE_ISENSE: U9.14(I1) ; port MOTOR_INTERFACE_ISENSE
PA4_MUX_SEL3: U9.9(C) ; port PA4_MUX_SEL3
PA5_MUX_SEL2: U9.10(B) ; port PA5_MUX_SEL2
PA6_MUX_SEL1: U9.11(A) ; port PA6_MUX_SEL1
PA7_MUX_OUT_EN: U9.6(INH) ; port PA7_MUX_OUT_EN
PB0_MUX_OUTPUT: U9.3(COM) ; port PB0_MUX_OUTPUT
PB2_ADC_VSENSE_INT: R21.2 TP8.TP U7.2(ALERT/RDY) ; port PB2_ADC_VSENSE_INT
PB12_ADC_FRONT_PWR_INT: R22.2 TP11.TP U8.2(ALERT/RDY) ; port PB12_ADC_FRONT_PWR_INT
REAR_BRK_LIGHT_ISENSE: U9.12(I3) ; port REAR_BRK_LIGHT_ISENSE
REAR_TURN_LIGHT_ISENSE: U9.13(I0) ; port REAR_TURN_LIGHT_ISENSE
SOLAR_TELEMETRY_ISENSE: U9.4(I7) ; port SOLAR_TELEMETRY_ISENSE
SPARE1_2_ISENSE: U9.2(I6) ; port SPARE1_2_ISENSE
SPARE3_4_ISENSE: U9.1(I4) ; port SPARE3_4_ISENSE
STROBE_CTR_BRK_ISENSE: U9.15(I2) ; port STROBE_CTR_BRK_ISENSE

### Notes on the sheet
- ADC
- I2C Address: 1001000 (0x48)
- I2C Address: 1001001 (0x49)
- (near U9) Multiplexer
- PROJECT
- DOCUMENT
- DRAWN BY
- LAST MODIFIED
- PART NUMBER
- REVISION
- SHEET
- VARIANT
- OF
- Engineering 5 - 1002
  University of Waterloo
  (519) 888-4567 x32978
  hardware@uwmidsun.com

### Library data of the parts
C18 C19 = CAP CER 0.1UF 50V 10% X7R 0603: as C1 on sheet Controller_Board_Interface; Supplier 1: Digi-Key; Supplier Part Number 1: 478-5052-1-ND; Packaging: Cut Tape (CT); Part Status: Active; Operating Temperature: -55°C ~ 125°C; Ratings: -; Mounting Type: Surface Mount, MLCC; Package / Case: 0603 (1608 Metric); Size / Dimension: 0.063" L x 0.032" W (1.60mm x 0.81mm); Height - Seated (Max): -; Thickness (Max): 0.035" (0.90mm); Lead Spacing: -; Lead Style: -; ComponentLink1URL: http://datasheets.avx.com/X7RDielectric.pdf; ComponentLink1Description: http://datasheets.avx.com/X7RDielectric.pdf; Tolerance: ±10%
R21 R22 = RES 4.7K OHM 1% 1/10W 0603: as R7#1 on sheet Controller_Board_Interface; Supplier 1: Digi-Key; Supplier Part Number 1: 311-4.70KHRCT-ND; RoHS: RoHS Compliant; Category: Resistors; Stock 1: 3487566; Pricing 1: 1=0.16, 10=0.022, 100=0.0089, 1000=0.00402, 2500=0.00349 (CAD); Packaging: Cut Tape (CT); Part Status: Active; Composition: Thick Film; Features: Moisture Resistant; Operating Temperature: -55°C ~ 155°C; Package / Case: 0603 (1608 Metric); Supplier Device Package: 0603; Size / Dimension: 0.063" L x 0.031" W (1.60mm x 0.80mm); Height - Seated (Max): 0.022" (0.55mm); Failure Rate: -; ComponentLink1URL: http://www.yageo.com/documents/recent/PYu-RC_Group_51_RoHS_L_7.pdf; ComponentLink1Description: http://www.yageo.com/documents/recent/PYu-RC_Group_51_RoHS_L_7.pdf; Tolerance: ±1%
U7 U8 = IC ADC 12-BIT VSSOP-10: 12 Bit Analog to Digital Converter 4 Input 1 Sigma-Delta 10-VSSOP; Manufacturer: Texas Instruments; Manufacturer Part Number: ADS1015IDGSR; Number of Bits: 12; Sampling Rate (Per Second): 3.3k; Number of Inputs: 2, 4; Input Type: Differential, Single Ended; Data Interface: I²C; Configuration: MUX-PGA-ADC; Number of A/D Converters: 1; Reference Type: Internal; Voltage - Supply, Analog: 2 V ~ 5.5 V; Supplier 1: Digi-Key; RoHS: RoHS Compliant; Category: Integrated Circuits (ICs); Stock 1: 4084; Pricing 1: 1=4.25, 10=3.807, 100=3.1194, 500=2.65552, 1000=2.23959 (CAD); Packaging: Cut Tape (CT); Part Status: Active; Ratio - S/H:ADC: -; Architecture: Sigma-Delta; Voltage - Supply, Digital: 2 V ~ 5.5 V; Features: PGA, Selectable Address; Operating Temperature: -40°C ~ 125°C; Package / Case: 10-TFSOP, 10-MSOP (0.118", 3.00mm Width); Supplier Device Package: 10-VSSOP; ComponentLink1URL: http://www.ti.com/lit/ds/symlink/ads1013.pdf; ComponentLink1Description: http://www.ti.com/lit/ds/symlink/ads1013.pdf
U9 = IC MUX/DMUX 8X1 16TSSOP: 1 Circuit IC Switch 8:1 75Ohm 16-TSSOP; Manufacturer: Texas Instruments; Number of Circuits: 1; Voltage - Supply, Single (V+): 2V ~ 5.5V; Channel-to-Channel Matching (ΔRon): 1.3Ohm; -3db Bandwidth: 35MHz; Switch Time (Ton, Toff) (Max): 14ns, 14ns; Channel Capacitance (CS(off), CD(off)): 0.5pF, 23.4pF; Current - Leakage (IS(off)) (Max): 100nA; Series: Automotive, AEC-Q100; Packaging: Cut Tape (CT); Part Status: Active; Multiplexer/Demultiplexer Circuit: 8:1; On-State Resistance (Max): 75Ohm; Voltage - Supply, Dual (V±): -; Crosstalk: -; Operating Temperature: -40°C ~ 125°C (TA); Charge Injection: -; Package / Case: 16-TSSOP (0.173", 4.40mm Width); Supplier Device Package: 16-TSSOP; Switch Circuit: -; Supplier 1: Digi-Key; Supplier Part Number 1: 296-29043-1-ND; ComponentLink1Description: http://www.ti.com/lit/ds/symlink/sn74lv4051a-q1.pdf; ComponentLink1URL: http://www.ti.com/lit/ds/symlink/sn74lv4051a-q1.pdf

## Sheet Power Distribution - IO Expander.SchDoc: Title
size B; Organization: Midnight Sun Solar Rayce Car Team; Address1: University of Waterloo; Address2: 200 University Ave W; Address3: Waterloo, ON, Canada; Address4: N2L 3E9; Website: www.uwmidsun.com; ProjectName: ProjectName
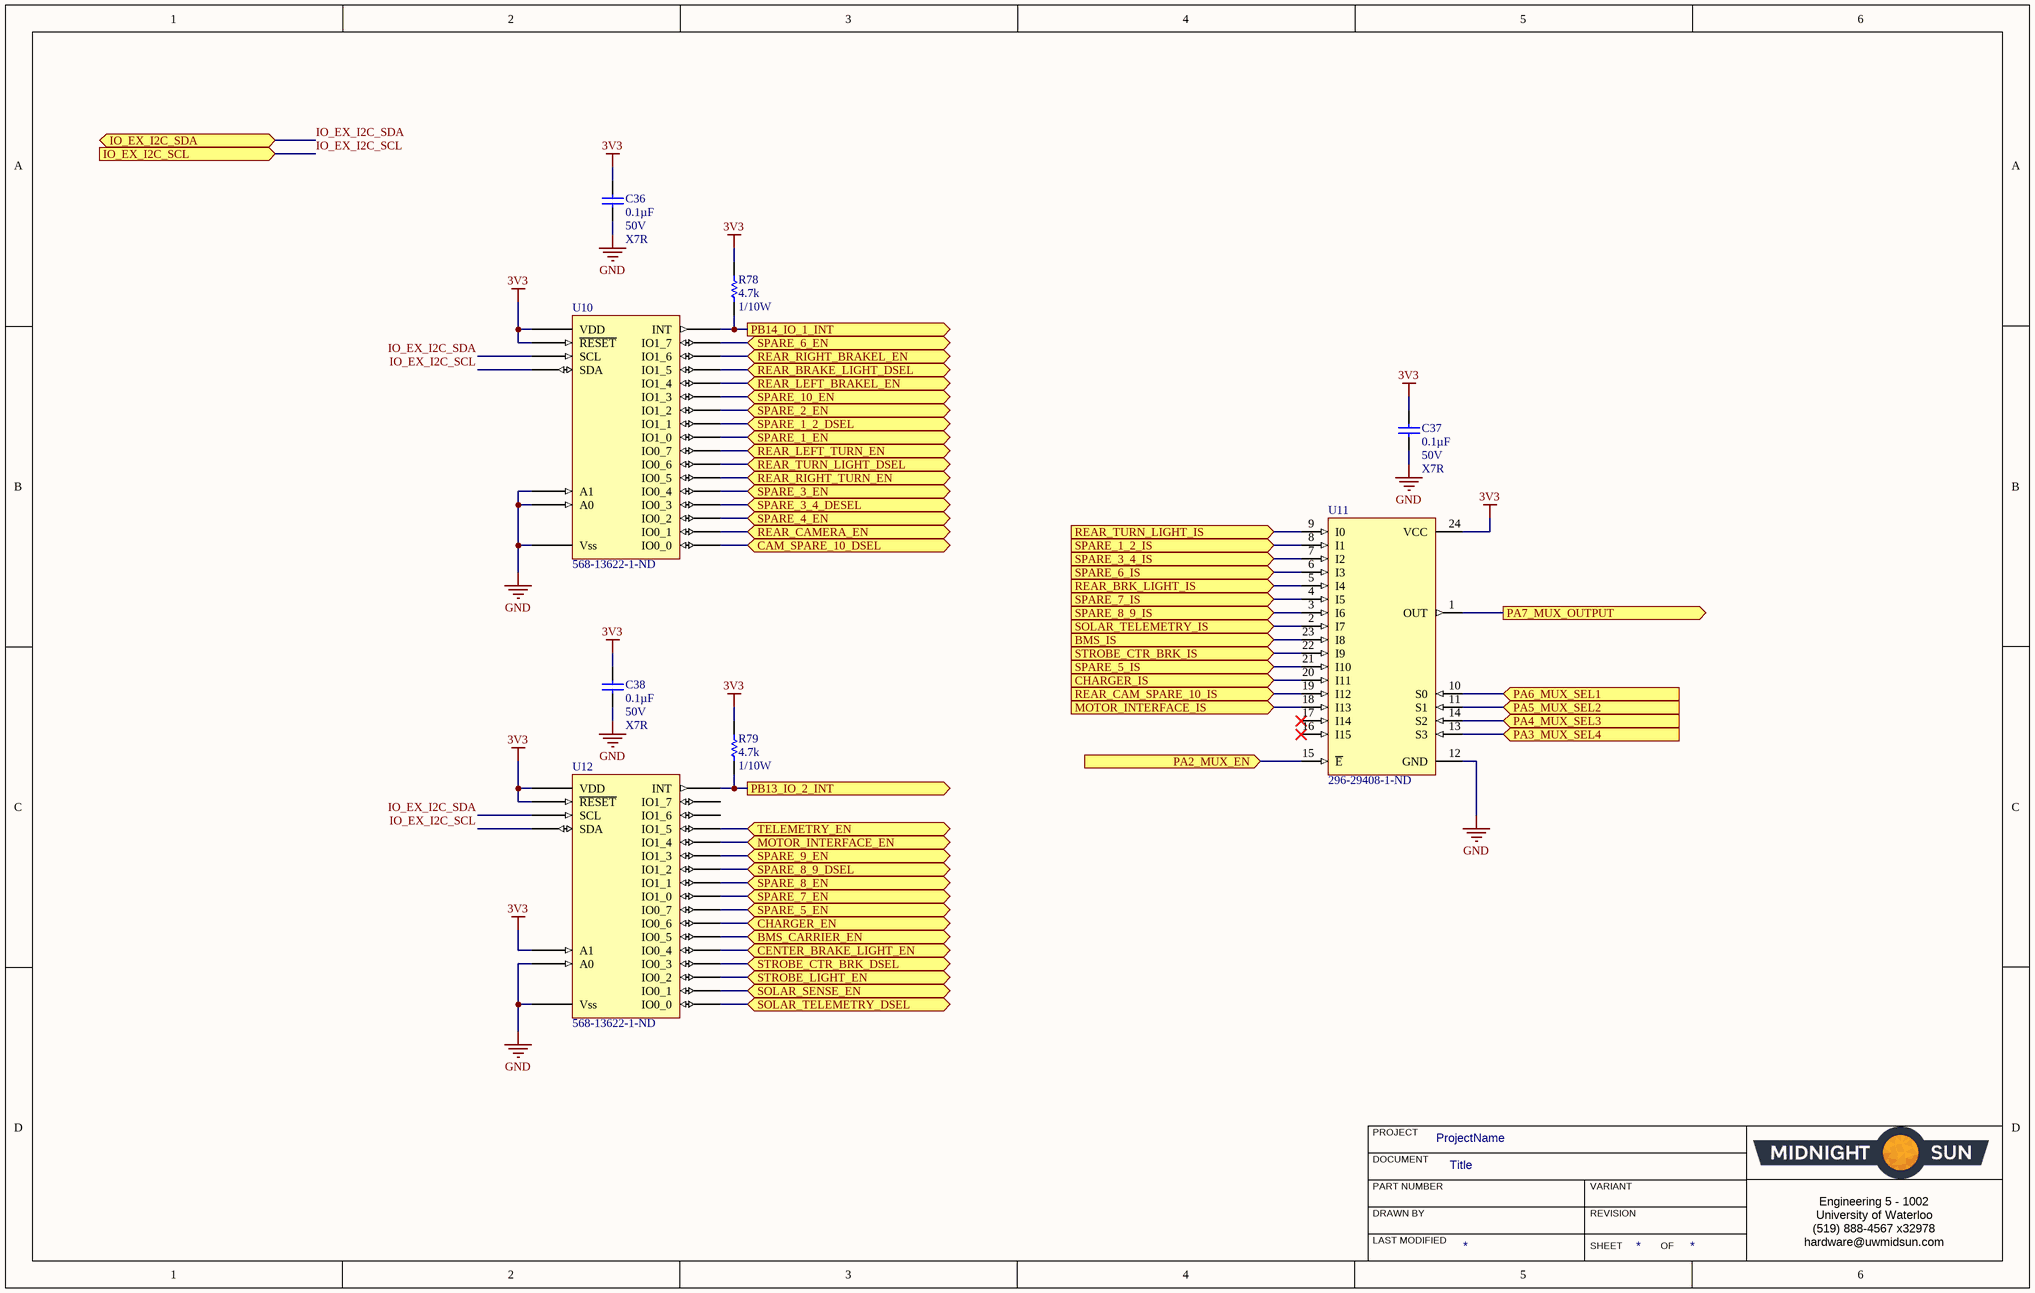
[diagram p7: Power Distribution - IO Expander.SchDoc]

### Parts
(Parts that share a designator on the sheet are numbered #1, #2 ... from top to bottom, then left to right.)
C36#2  Capacitance: 0.1µF  Voltage: 50V  Temperature Coefficient: X7R  [CAP, 0603]  (hidden comment: CAP CER 0.1UF 50V 10% X7R 0603)
C37#2  Capacitance: 0.1µF  Voltage: 50V  Temperature Coefficient: X7R  [CAP, 0603]  (hidden comment: CAP CER 0.1UF 50V 10% X7R 0603)
C38#2  Capacitance: 0.1µF  Voltage: 50V  Temperature Coefficient: X7R  [CAP, 0603]  (hidden comment: CAP CER 0.1UF 50V 10% X7R 0603)
R78#1  Resistance (Ohms): 4.7k  Power (Watts): 1/10W  [RES, 0603]  (hidden comment: RES 4.7K OHM 1% 1/10W 0603)
R79#1  Resistance (Ohms): 4.7k  Power (Watts): 1/10W  [RES, 0603]  (hidden comment: RES 4.7K OHM 1% 1/10W 0603)
U10  Supplier Part Number 1: 568-13622-1-ND  [SOP127P600-8N]  (hidden comment: 16-BIT I2C-BUS AND SMBUS LOW POW)
U11  Supplier Part Number 1: 296-29408-1-ND  [SOP127P1030X265-24N]  (hidden comment: IC MUX/DEMUX 1X16 24SSOP)
U12  Supplier Part Number 1: 568-13622-1-ND  [SOP127P600-8N]  (hidden comment: 16-BIT I2C-BUS AND SMBUS LOW POW)

### Ports
BMS_CARRIER_EN (bidir), BMS_IS (in), CAM_SPARE_10_DSEL (bidir), CENTER_BRAKE_LIGHT_EN (bidir), CHARGER_EN (bidir), CHARGER_IS (in), IO_EX_I2C_SCL (in), IO_EX_I2C_SDA (bidir), MOTOR_INTERFACE_EN (bidir), MOTOR_INTERFACE_IS (in), PA2_MUX_EN (in), PA3_MUX_SEL4 (in), PA4_MUX_SEL3 (in), PA5_MUX_SEL2 (in), PA6_MUX_SEL1 (in), PA7_MUX_OUTPUT (out), PB13_IO_2_INT (out), PB14_IO_1_INT (out), REAR_BRAKE_LIGHT_DSEL (bidir), REAR_BRK_LIGHT_IS (in), REAR_CAM_SPARE_10_IS (in), REAR_CAMERA_EN (bidir), REAR_LEFT_BRAKEL_EN (bidir), REAR_LEFT_TURN_EN (bidir), REAR_RIGHT_BRAKEL_EN (bidir), REAR_RIGHT_TURN_EN (bidir), REAR_TURN_LIGHT_DSEL (bidir), REAR_TURN_LIGHT_IS (in), SOLAR_SENSE_EN (bidir), SOLAR_TELEMETRY_DSEL (bidir), SOLAR_TELEMETRY_IS (in), SPARE_1_2_DSEL (bidir), SPARE_1_2_IS (in), SPARE_1_EN (bidir), SPARE_2_EN (bidir), SPARE_3_4_DESEL (bidir), SPARE_3_4_IS (in), SPARE_3_EN (bidir), SPARE_4_EN (bidir), SPARE_5_EN (bidir), SPARE_5_IS (in), SPARE_6_EN (bidir), SPARE_6_IS (in), SPARE_7_EN (bidir), SPARE_7_IS (in), SPARE_8_9_DSEL (bidir), SPARE_8_9_IS (in), SPARE_8_EN (bidir), SPARE_9_EN (bidir), SPARE_10_EN (bidir), STROBE_CTR_BRK_DSEL (bidir), STROBE_CTR_BRK_IS (in), STROBE_LIGHT_EN (bidir), TELEMETRY_EN (bidir)

### Nets
3V3: C36#2.1 C37#2.1 C38#2.1 R78#1.1 R79#1.1 U10.3(~{RESET}) U10.24(VDD) U11.24(VCC) U12.2(A1) U12.3(~{RESET}) U12.24(VDD)
GND: C36#2.2 C37#2.2 C38#2.2 U10.2(A1) U10.12(Vss) U10.21(A0) U11.12(GND) U12.12(Vss) U12.21(A0)
BMS_CARRIER_EN: U12.9(IO0_5) ; port BMS_CARRIER_EN
BMS_IS: U11.23(I8) ; port BMS_IS
CAM_SPARE_10_DSEL: U10.4(IO0_0) ; port CAM_SPARE_10_DSEL
CENTER_BRAKE_LIGHT_EN: U12.8(IO0_4) ; port CENTER_BRAKE_LIGHT_EN
CHARGER_EN: U12.10(IO0_6) ; port CHARGER_EN
CHARGER_IS: U11.20(I11) ; port CHARGER_IS
IO_EX_I2C_SCL: U10.23(SDA) U12.23(SDA) ; port IO_EX_I2C_SCL
IO_EX_I2C_SDA: U10.22(SCL) U12.22(SCL) ; port IO_EX_I2C_SDA
MOTOR_INTERFACE_EN: U12.17(IO1_4) ; port MOTOR_INTERFACE_EN
MOTOR_INTERFACE_IS: U11.18(I13) ; port MOTOR_INTERFACE_IS
PA2_MUX_EN: U11.15(~{E}) ; port PA2_MUX_EN
PA3_MUX_SEL4: U11.13(S3) ; port PA3_MUX_SEL4
PA4_MUX_SEL3: U11.14(S2) ; port PA4_MUX_SEL3
PA5_MUX_SEL2: U11.11(S1) ; port PA5_MUX_SEL2
PA6_MUX_SEL1: U11.10(S0) ; port PA6_MUX_SEL1
PA7_MUX_OUTPUT: U11.1(OUT) ; port PA7_MUX_OUTPUT
PB13_IO_2_INT: R79#1.2 U12.1(INT) ; port PB13_IO_2_INT
PB14_IO_1_INT: R78#1.2 U10.1(INT) ; port PB14_IO_1_INT
REAR_BRAKE_LIGHT_DSEL: U10.18(IO1_5) ; port REAR_BRAKE_LIGHT_DSEL
REAR_BRK_LIGHT_IS: U11.5(I4) ; port REAR_BRK_LIGHT_IS
REAR_CAM_SPARE_10_IS: U11.19(I12) ; port REAR_CAM_SPARE_10_IS
REAR_CAMERA_EN: U10.5(IO0_1) ; port REAR_CAMERA_EN
REAR_LEFT_BRAKEL_EN: U10.17(IO1_4) ; port REAR_LEFT_BRAKEL_EN
REAR_LEFT_TURN_EN: U10.11(IO0_7) ; port REAR_LEFT_TURN_EN
REAR_RIGHT_BRAKEL_EN: U10.19(IO1_6) ; port REAR_RIGHT_BRAKEL_EN
REAR_RIGHT_TURN_EN: U10.9(IO0_5) ; port REAR_RIGHT_TURN_EN
REAR_TURN_LIGHT_DSEL: U10.10(IO0_6) ; port REAR_TURN_LIGHT_DSEL
REAR_TURN_LIGHT_IS: U11.9(I0) ; port REAR_TURN_LIGHT_IS
SOLAR_SENSE_EN: U12.5(IO0_1) ; port SOLAR_SENSE_EN
SOLAR_TELEMETRY_DSEL: U12.4(IO0_0) ; port SOLAR_TELEMETRY_DSEL
SOLAR_TELEMETRY_IS: U11.2(I7) ; port SOLAR_TELEMETRY_IS
SPARE_1_2_DSEL: U10.14(IO1_1) ; port SPARE_1_2_DSEL
SPARE_1_2_IS: U11.8(I1) ; port SPARE_1_2_IS
SPARE_1_EN: U10.13(IO1_0) ; port SPARE_1_EN
SPARE_2_EN: U10.15(IO1_2) ; port SPARE_2_EN
SPARE_3_4_DESEL: U10.7(IO0_3) ; port SPARE_3_4_DESEL
SPARE_3_4_IS: U11.7(I2) ; port SPARE_3_4_IS
SPARE_3_EN: U10.8(IO0_4) ; port SPARE_3_EN
SPARE_4_EN: U10.6(IO0_2) ; port SPARE_4_EN
SPARE_5_EN: U12.11(IO0_7) ; port SPARE_5_EN
SPARE_5_IS: U11.21(I10) ; port SPARE_5_IS
SPARE_6_EN: U10.20(IO1_7) ; port SPARE_6_EN
SPARE_6_IS: U11.6(I3) ; port SPARE_6_IS
SPARE_7_EN: U12.13(IO1_0) ; port SPARE_7_EN
SPARE_7_IS: U11.4(I5) ; port SPARE_7_IS
SPARE_8_9_DSEL: U12.15(IO1_2) ; port SPARE_8_9_DSEL
SPARE_8_9_IS: U11.3(I6) ; port SPARE_8_9_IS
SPARE_8_EN: U12.14(IO1_1) ; port SPARE_8_EN
SPARE_9_EN: U12.16(IO1_3) ; port SPARE_9_EN
SPARE_10_EN: U10.16(IO1_3) ; port SPARE_10_EN
STROBE_CTR_BRK_DSEL: U12.7(IO0_3) ; port STROBE_CTR_BRK_DSEL
STROBE_CTR_BRK_IS: U11.22(I9) ; port STROBE_CTR_BRK_IS
STROBE_LIGHT_EN: U12.6(IO0_2) ; port STROBE_LIGHT_EN
TELEMETRY_EN: U12.18(IO1_5) ; port TELEMETRY_EN

Not connected (* = marked no-connect by the designer): U11 16(I15)* 17(I14)*; U12 19(IO1_6) 20(IO1_7)

### Notes on the sheet
- PROJECT
- DOCUMENT
- DRAWN BY
- LAST MODIFIED
- PART NUMBER
- REVISION
- SHEET
- VARIANT
- OF
- Engineering 5 - 1002
  University of Waterloo
  (519) 888-4567 x32978
  hardware@uwmidsun.com

### Library data of the parts
C36#2 C37#2 C38#2 = CAP CER 0.1UF 50V 10% X7R 0603: 0.10µF ±10% 50V Ceramic Capacitor X7R 0603 (1608 Metric); Manufacturer 1: AVX Corporation; Manufacturer Part Number 1: 06035C104KAT2A; Supplier 1: Digi-Key; Supplier Part Number 1: 478-5052-1-ND; Packaging: Cut Tape (CT); Part Status: Active; Operating Temperature: -55°C ~ 125°C; Ratings: -; Mounting Type: Surface Mount, MLCC; Package / Case: 0603 (1608 Metric); Size / Dimension: 0.063" L x 0.032" W (1.60mm x 0.81mm); Height - Seated (Max): -; Thickness (Max): 0.035" (0.90mm); Lead Spacing: -; Lead Style: -; ComponentLink1URL: http://datasheets.avx.com/X7RDielectric.pdf; ComponentLink1Description: http://datasheets.avx.com/X7RDielectric.pdf; Tolerance: ±10%
R78#1 R79#1 = RES 4.7K OHM 1% 1/10W 0603: 4.7k Ohm ±1% 0.1W, 1/10W Chip Resistor 0603 (1608 Metric) Moisture Resistant Thick Film; Manufacturer 1: Yageo; Manufacturer Part Number 1: RC0603FR-074K7L; Description 1: RES SMD 4.7K OHM 1% 1/10W 0603; Temperature Coefficient: ±100ppm/°C; Supplier 1: Digi-Key; Supplier Part Number 1: 311-4.70KHRCT-ND; RoHS: RoHS Compliant; Category: Resistors; Stock 1: 3487566; Pricing 1: 1=0.16, 10=0.022, 100=0.0089, 1000=0.00402, 2500=0.00349 (CAD); Packaging: Cut Tape (CT); Part Status: Active; Composition: Thick Film; Features: Moisture Resistant; Operating Temperature: -55°C ~ 155°C; Package / Case: 0603 (1608 Metric); Supplier Device Package: 0603; Size / Dimension: 0.063" L x 0.031" W (1.60mm x 0.80mm); Height - Seated (Max): 0.022" (0.55mm); Failure Rate: -; ComponentLink1URL: http://www.yageo.com/documents/recent/PYu-RC_Group_51_RoHS_L_7.pdf; ComponentLink1Description: http://www.yageo.com/documents/recent/PYu-RC_Group_51_RoHS_L_7.pdf; Tolerance: ±1%
U10 U12 = 16-BIT I2C-BUS AND SMBUS LOW POW: I/O Expander 16 I²C, SMBus 400kHz 24-TSSOP; ComponentLink1Description: https://www.nxp.com/docs/en/data-sheet/PCA9539_PCA9539R.pdf; ComponentLink1URL: https://www.nxp.com/docs/en/data-sheet/PCA9539_PCA9539R.pdf; Supplier 1: Digi-Key
U11 = IC MUX/DEMUX 1X16 24SSOP: 1 Circuit IC Switch 16:1 160 Ohm 24-SOIC; Manufacturer: Texas Instruments; Manufacturer Part Number: CD74HC4067M96; Number of Channels: 1; Number of Inputs: 16; Max Supply Voltage: 6V; Min Supply Voltage: 2V; Bandwidth: 89MHz; Propagation Delay: 75ns; On-State Resistance: 180R; Turn-On Delay Time: 300ns; Turn-Off Delay Time: 290ns; Logic Function: Demultiplexer,Multiplexer; Operating Supply Current: 8uA; Supply Type: Single; Low Level Output Current: 25mA; ComponentLink1URL: http://www.ti.com/lit/ds/symlink/cd74hc4067.pdf; ComponentLink1Description: http://www.ti.com/lit/ds/symlink/cd74hc4067.pdf; Supplier 1: Digi-Key; Stock 1: 10305; Pricing 1: 1 = 0.80000, 10 = 0.70400, 100 = 0.53940, 500 = 0.42642, 1000 = 0.34114 (USD); RoHS: Yes; Mount: Surface Mount; Case/Package: SOIC; Number of Pins: 24; Weight: 0.022025oz; Contact Plating: Matte,Tin; Min Operating Temperature: -55°C; Max Operating Temperature: 125°C; Number of Outputs: 1; Packaging: Tape and Reel; Package Quantity: 2000; Number of Circuits: 1; Nominal Supply Current: 8uA; Number of Bits: 16; High Level Output Current: 25mA; Length: 15.4mm; Height: 2.35mm; Width: 7.52mm; Radiation Hardening: No; REACH SVHC: No SVHC; Lead Free: Lead Free; ComponentLink2URL: https://www.verical.com/server-webapp/html/getDatasheet?partID=322813&src-supplier=Verical; ComponentLink2Description: https://www.verical.com/server-webapp/html/getDatasheet?partID=322813&src-supplier=Verical; ComponentLink3URL: http://focus.ti.com/lit/ds/symlink/cd74hc4067.pdf?src-supplier=Avnet+Europe; ComponentLink3Description: http://focus.ti.com/lit/ds/symlink/cd74hc4067.pdf?src-supplier=Avnet+Europe; ComponentLink4URL: http://www.ti.com/lit/ds/symlink/cd74hc4067.pdf?src-supplier=Digi-Key; ComponentLink4Description: http://www.ti.com/lit/ds/symlink/cd74hc4067.pdf?src-supplier=Digi-Key